# EAGLE schematic cnc.rev.1 (EAGLE 7.2.0)
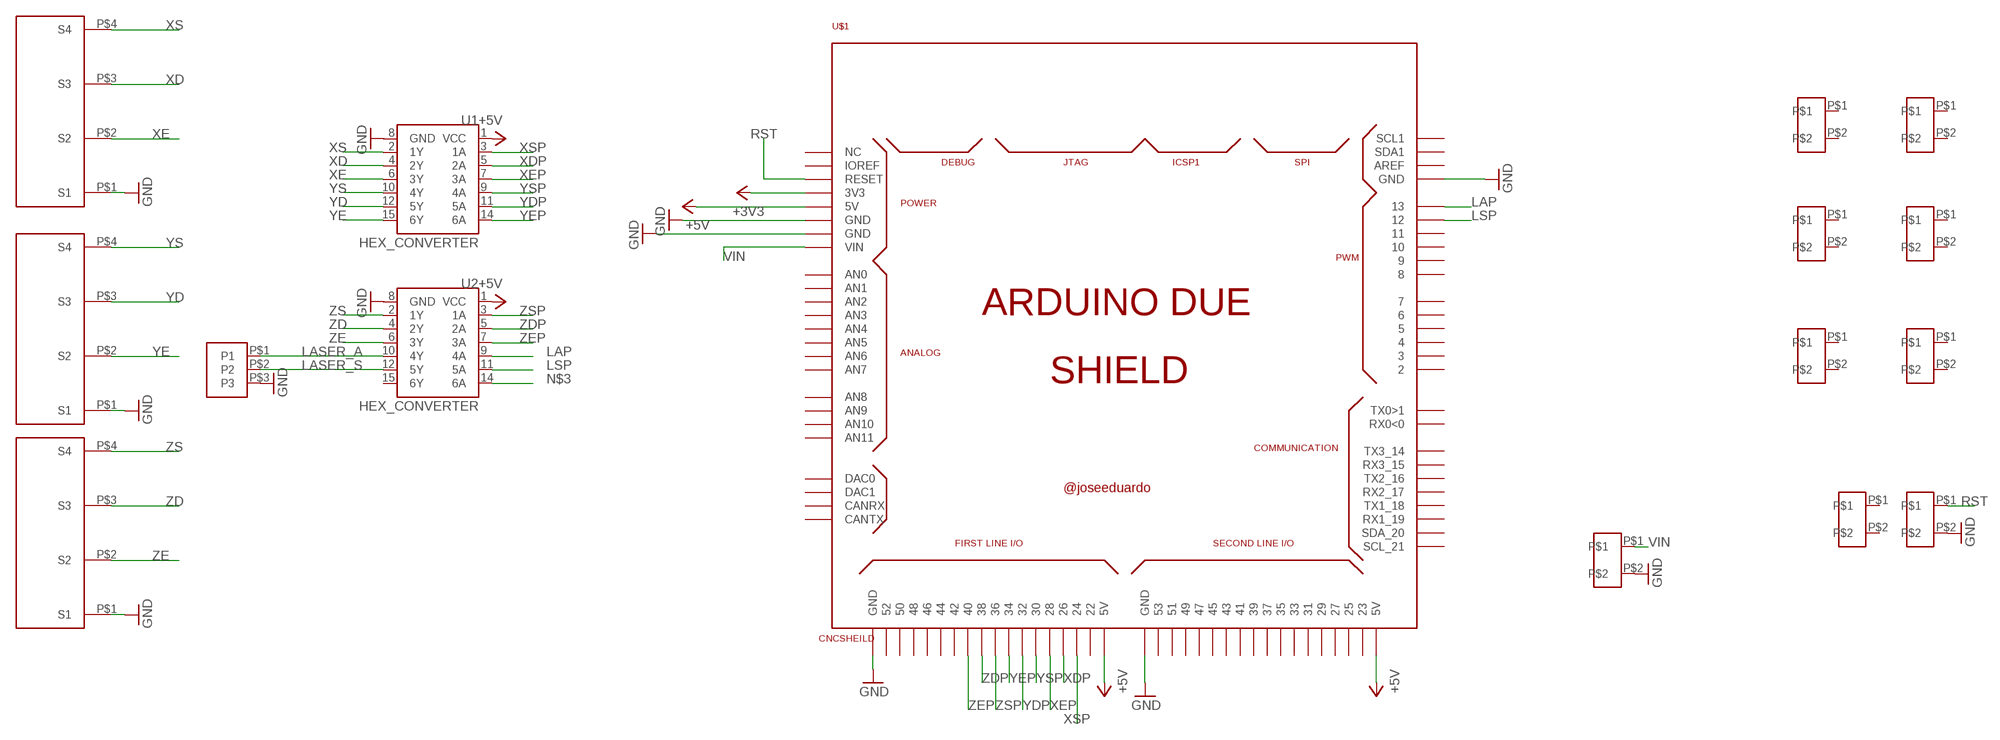
[diagram p0: schematic, sheet 1]

## Parts
INPUT  PIN_LOCK_1X2  [PIN_LOCK1X2]
U1  HEX_CONVERTER  [SO016]
U2  HEX_CONVERTER  [SO016]
U$1  CNCSHEILD  [CNCSHEILD]
U$2  TBC1X4  [PTC1X4]
U$3  TBC1X4  [PTC1X4]
U$4  TBC1X4  [PTC1X4]
U$5  PIN_LOCK_1X2  [PIN_LOCK1X2]
U$6  PIN_LOCK_1X2  [PIN_LOCK1X2]
U$7  PIN_LOCK_1X2  [PIN_LOCK1X2]
U$8  PIN_LOCK_1X2  [PIN_LOCK1X2]
U$9  PIN_LOCK_1X2  [PIN_LOCK1X2]
U$10  PIN_LOCK_1X2  [PIN_LOCK1X2]
U$11  PIN_LOCK_1X2  [PIN_LOCK1X2]
U$12  PIN_LOCK_1X2  [PIN_LOCK1X2]
U$13  PIN_LOCK_1X3  [PIN_LOCK1X3]

## Nets
+3V3: U$1.3V3
+5V: U1.1(VCC) U2.1(VCC) U$1.5V0(5V) U$1.5V0_1(5V) U$1.5V0_2(5V)
GND: INPUT.P$2 U$1.GND U$1.GND_1(GND) U$1.GND_2(GND) U$1.GND_3(GND) U$1.GND_4(GND) U$2.P$1(S1) U$3.P$1(S1) U$4.P$1(S1) U$11.P$2
LAP: U2.9(4A) U$1.13
LASER_A: U2.10(4Y) U$13.P$1(P1)
LASER_S: U2.12(5Y) U$13.P$2(P2)
LSP: U2.11(5A) U$1.12
N$3: U2.14(6A)
RST: U$1.RESET U$11.P$1
VIN: INPUT.P$1 U$1.VIN
XD: U1.4(2Y) U$4.P$3(S3)
XDP: U1.5(2A) U$1.26
XE: U1.6(3Y) U$4.P$2(S2)
XEP: U1.7(3A) U$1.28
XS: U1.2(1Y) U$4.P$4(S4)
XSP: U1.3(1A) U$1.24
YD: U1.12(5Y) U$2.P$3(S3)
YDP: U1.11(5A) U$1.32
YE: U1.15(6Y) U$2.P$2(S2)
YEP: U1.14(6A) U$1.34
YS: U1.10(4Y) U$2.P$4(S4)
YSP: U1.9(4A) U$1.30
ZD: U2.4(2Y) U$3.P$3(S3)
ZDP: U2.5(2A) U$1.38
ZE: U2.6(3Y) U$3.P$2(S2)
ZEP: U2.7(3A) U$1.40
ZS: U2.2(1Y) U$3.P$4(S4)
ZSP: U2.3(1A) U$1.36
Unconnected: U1.8(GND) U2.8(GND) U2.15(6Y) U$1.0(RX0<0) U$1.1(TX0>1) U$1.2 U$1.3 U$1.4 U$1.5 U$1.6 U$1.7 U$1.8 U$1.9 U$1.10 U$1.11 U$1.14(TX3_14) U$1.15(RX3_15) U$1.16(TX2_16) U$1.17(RX2_17) U$1.18(TX1_18) U$1.19(RX1_19) U$1.20(SDA_20) U$1.21(SCL_21) U$1.22 U$1.23 U$1.25 U$1.27 U$1.29 U$1.31 U$1.33 U$1.35 U$1.37 U$1.39 U$1.41 U$1.42 U$1.43 U$1.44 U$1.45 U$1.46 U$1.47 U$1.48 U$1.49 U$1.50 U$1.51 U$1.52 U$1.53 U$1.A0(AN0) U$1.A1(AN1) U$1.A2(AN2) U$1.A3(AN3) U$1.A4(AN4) U$1.A5(AN5) U$1.A6(AN6) U$1.A7(AN7) U$1.A8(AN8) U$1.A9(AN9) U$1.A10(AN10) U$1.A11(AN11) U$1.AREF U$1.CANRX U$1.CANTX U$1.DAC0 U$1.DAC1 U$1.IOREF U$1.NC_2(NC) U$1.SCL1 U$1.SDA1 U$5.P$1 U$5.P$2 U$6.P$1 U$6.P$2 U$7.P$1 U$7.P$2 U$8.P$1 U$8.P$2 U$9.P$1 U$9.P$2 U$10.P$1 U$10.P$2 U$12.P$1 U$12.P$2 U$13.P$3(P3)

## Library data of the parts
INPUT U$5-U$12 = ARDUINO_MODULE:PIN_LOCK_1X2
U1 U2 = SparkFun-DigitalIC:HEX_CONVERTER: 74HC4050 Hex Buffer Level Shifter SMD SO016; PROD_ID: IC-09604
U$1 = arduino_due_shield:CNCSHEILD
U$2-U$4 = ARDUINO_MODULE:TBC1X4
U$13 = ARDUINO_MODULE:PIN_LOCK_1X3